# Altium schematic sheet LPCB225 - OVERVIEW.SchDoc
size A3; Address1: Factory 10; Address2: 9-13 Dingley Avenue, Dandeong, VICTORIA 3175, AUSTRALIA; DocumentNumber: 1; Revision: 1; SheetNumber: 1; SheetTotal: 6; Lockie__PCB_SUB_ASSEMBLY: Overview; Lockie__PCB_ASSEMBLY: Module; Lockie__LDL: LPCB225; Lockie__PCB_DESCRIPTION: BMS Module
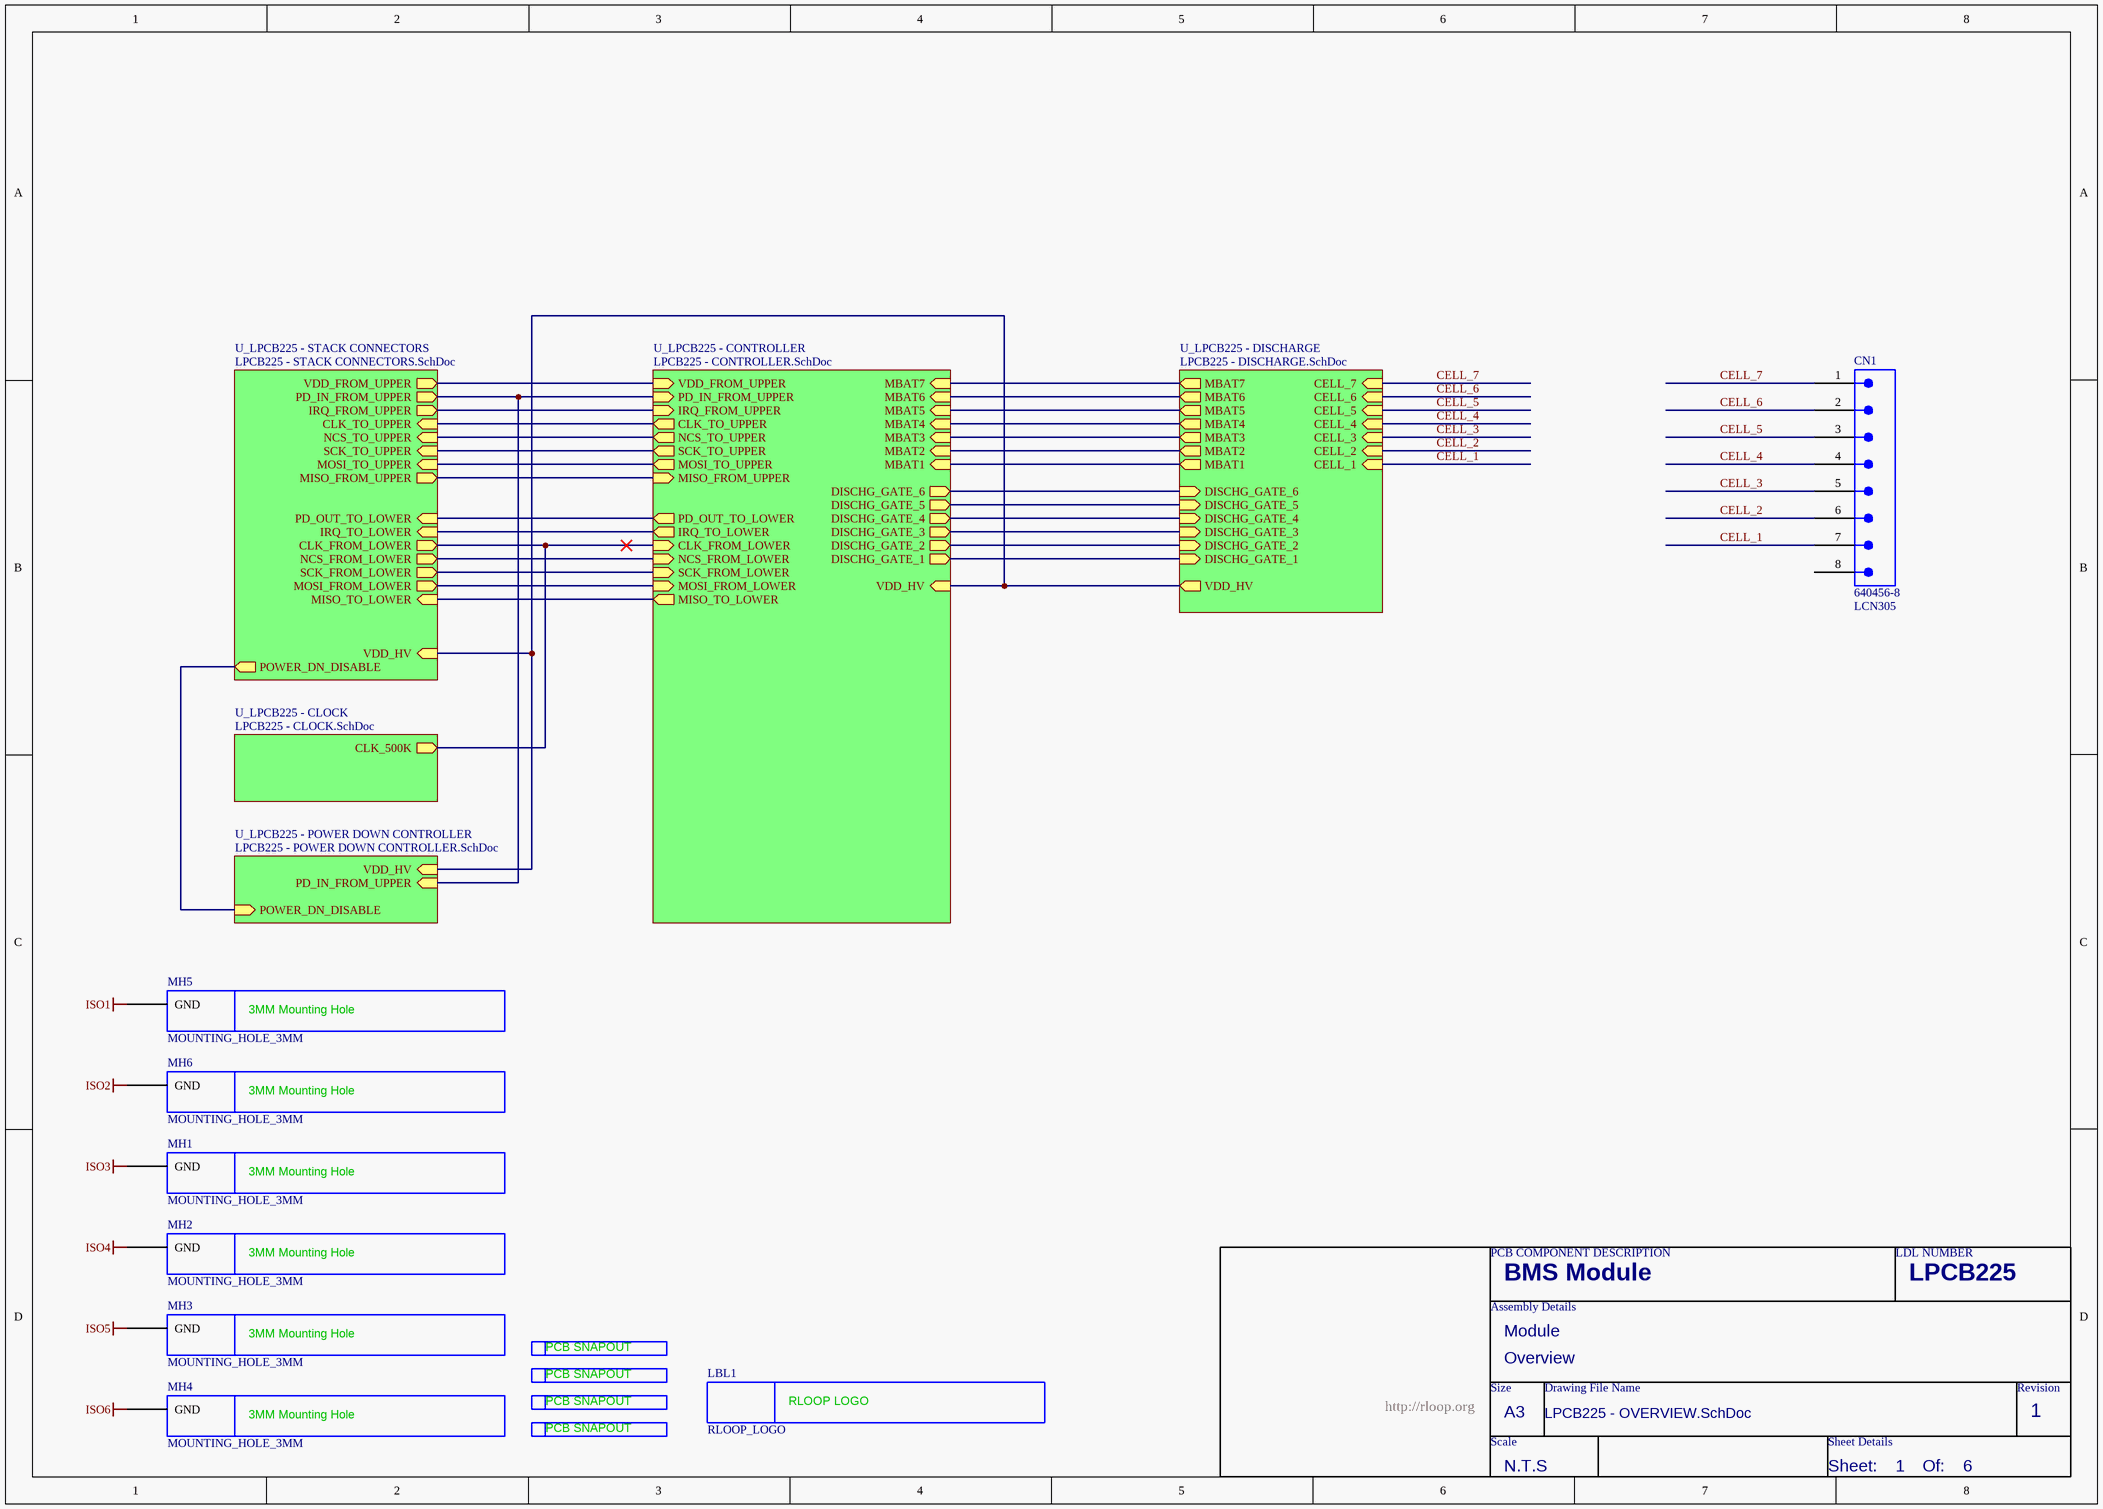
[diagram p0: LPCB225 - OVERVIEW.SchDoc]

## Parts
CN1  640456-8  LDL_NUMBER: LCN305  [640456-8]
LBL1  RLOOP_LOGO  [RLOOP_LOGO]  (no BOM)
MH1  MOUNTING_HOLE_3MM  [MOUNTING_HOLE_3MM]  (no BOM)
MH2  MOUNTING_HOLE_3MM  [MOUNTING_HOLE_3MM]  (no BOM)
MH3  MOUNTING_HOLE_3MM  [MOUNTING_HOLE_3MM]  (no BOM)
MH4  MOUNTING_HOLE_3MM  [MOUNTING_HOLE_3MM]  (no BOM)
MH5  MOUNTING_HOLE_3MM  [MOUNTING_HOLE_3MM]  (no BOM)
MH6  MOUNTING_HOLE_3MM  [MOUNTING_HOLE_3MM]  (no BOM)
SN1  PCB_SNAPOUT  [SNAPOUT_NEW]  (value not drawn)  (no BOM)
SN2  PCB_SNAPOUT  [SNAPOUT_NEW]  (value not drawn)  (no BOM)
SN3  PCB_SNAPOUT  [SNAPOUT_NEW]  (value not drawn)  (no BOM)
SN4  PCB_SNAPOUT  [SNAPOUT_NEW]  (value not drawn)  (no BOM)

## Sub-sheets
U_LPCB225 - CLOCK = LPCB225 - CLOCK.SchDoc: CLK_500K (out)
U_LPCB225 - CONTROLLER = LPCB225 - CONTROLLER.SchDoc: PD_IN_FROM_UPPER (in), PD_OUT_TO_LOWER (out), IRQ_FROM_UPPER (in), CLK_TO_UPPER (out), NCS_TO_UPPER (out), SCK_TO_UPPER (out), MOSI_TO_UPPER (out), MISO_FROM_UPPER (in), IRQ_TO_LOWER (out), CLK_FROM_LOWER (in), NCS_FROM_LOWER (in), SCK_FROM_LOWER (in), MOSI_FROM_LOWER (in), MISO_TO_LOWER (out), VDD_FROM_UPPER (in), VDD_HV (in), MBAT7 (in), MBAT1 (in), MBAT2 (in), MBAT3 (in), MBAT4 (in), MBAT5 (in), MBAT6 (in), DISCHG_GATE_1 (out), DISCHG_GATE_2 (out), DISCHG_GATE_3 (out), DISCHG_GATE_4 (out), DISCHG_GATE_5 (out), DISCHG_GATE_6 (out)
U_LPCB225 - DISCHARGE = LPCB225 - DISCHARGE.SchDoc: CELL_7 (in), MBAT7 (out), DISCHG_GATE_6 (in), MBAT6 (out), DISCHG_GATE_5 (in), CELL_6 (in), MBAT5 (out), DISCHG_GATE_4 (in), CELL_5 (in), MBAT4 (out), DISCHG_GATE_3 (in), CELL_4 (in), MBAT3 (out), DISCHG_GATE_2 (in), CELL_3 (in), MBAT2 (out), DISCHG_GATE_1 (in), CELL_2 (in), CELL_1 (in), MBAT1 (out), VDD_HV (out)
U_LPCB225 - POWER DOWN CONTROLLER = LPCB225 - POWER DOWN CONTROLLER.SchDoc: PD_IN_FROM_UPPER (in), VDD_HV (in), POWER_DN_DISABLE (in)
U_LPCB225 - STACK CONNECTORS = LPCB225 - STACK CONNECTORS.SchDoc: PD_IN_FROM_UPPER (out), IRQ_FROM_UPPER (out), CLK_TO_UPPER (in), NCS_TO_UPPER (in), SCK_TO_UPPER (in), MOSI_TO_UPPER (in), MISO_FROM_UPPER (out), VDD_FROM_UPPER (out), PD_OUT_TO_LOWER (in), IRQ_TO_LOWER (in), CLK_FROM_LOWER (out), NCS_FROM_LOWER (out), SCK_FROM_LOWER (out), MOSI_FROM_LOWER (out), MISO_TO_LOWER (in), VDD_HV (in), POWER_DN_DISABLE (out)

## Nets
ISO1: MH5.MOUNT(GND)
ISO2: MH6.MOUNT(GND)
ISO3: MH1.MOUNT(GND)
ISO4: MH2.MOUNT(GND)
ISO5: MH3.MOUNT(GND)
ISO6: MH4.MOUNT(GND)
CELL_1: CN1.7 ; sheet U_LPCB225 - DISCHARGE/CELL_1
CELL_2: CN1.6 ; sheet U_LPCB225 - DISCHARGE/CELL_2
CELL_3: CN1.5 ; sheet U_LPCB225 - DISCHARGE/CELL_3
CELL_4: CN1.4 ; sheet U_LPCB225 - DISCHARGE/CELL_4
CELL_5: CN1.3 ; sheet U_LPCB225 - DISCHARGE/CELL_5
CELL_6: CN1.2 ; sheet U_LPCB225 - DISCHARGE/CELL_6
CELL_7: CN1.1 ; sheet U_LPCB225 - DISCHARGE/CELL_7
(unnamed): sheet U_LPCB225 - CONTROLLER/PD_IN_FROM_UPPER, sheet U_LPCB225 - STACK CONNECTORS/PD_IN_FROM_UPPER, sheet U_LPCB225 - POWER DOWN CONTROLLER/PD_IN_FROM_UPPER
(unnamed): sheet U_LPCB225 - CONTROLLER/PD_OUT_TO_LOWER, sheet U_LPCB225 - STACK CONNECTORS/PD_OUT_TO_LOWER
(unnamed): sheet U_LPCB225 - CONTROLLER/IRQ_FROM_UPPER, sheet U_LPCB225 - STACK CONNECTORS/IRQ_FROM_UPPER
(unnamed): sheet U_LPCB225 - CONTROLLER/CLK_TO_UPPER, sheet U_LPCB225 - STACK CONNECTORS/CLK_TO_UPPER
(unnamed): sheet U_LPCB225 - CONTROLLER/NCS_TO_UPPER, sheet U_LPCB225 - STACK CONNECTORS/NCS_TO_UPPER
(unnamed): sheet U_LPCB225 - CONTROLLER/SCK_TO_UPPER, sheet U_LPCB225 - STACK CONNECTORS/SCK_TO_UPPER
(unnamed): sheet U_LPCB225 - CONTROLLER/MOSI_TO_UPPER, sheet U_LPCB225 - STACK CONNECTORS/MOSI_TO_UPPER
(unnamed): sheet U_LPCB225 - CONTROLLER/MISO_FROM_UPPER, sheet U_LPCB225 - STACK CONNECTORS/MISO_FROM_UPPER
(unnamed): sheet U_LPCB225 - CONTROLLER/IRQ_TO_LOWER, sheet U_LPCB225 - STACK CONNECTORS/IRQ_TO_LOWER
(unnamed): sheet U_LPCB225 - CONTROLLER/CLK_FROM_LOWER, sheet U_LPCB225 - STACK CONNECTORS/CLK_FROM_LOWER, sheet U_LPCB225 - CLOCK/CLK_500K
(unnamed): sheet U_LPCB225 - CONTROLLER/NCS_FROM_LOWER, sheet U_LPCB225 - STACK CONNECTORS/NCS_FROM_LOWER
(unnamed): sheet U_LPCB225 - CONTROLLER/SCK_FROM_LOWER, sheet U_LPCB225 - STACK CONNECTORS/SCK_FROM_LOWER
(unnamed): sheet U_LPCB225 - CONTROLLER/MOSI_FROM_LOWER, sheet U_LPCB225 - STACK CONNECTORS/MOSI_FROM_LOWER
(unnamed): sheet U_LPCB225 - CONTROLLER/MISO_TO_LOWER, sheet U_LPCB225 - STACK CONNECTORS/MISO_TO_LOWER
(unnamed): sheet U_LPCB225 - CONTROLLER/VDD_FROM_UPPER, sheet U_LPCB225 - STACK CONNECTORS/VDD_FROM_UPPER
(unnamed): sheet U_LPCB225 - CONTROLLER/VDD_HV, sheet U_LPCB225 - DISCHARGE/VDD_HV, sheet U_LPCB225 - STACK CONNECTORS/VDD_HV, sheet U_LPCB225 - POWER DOWN CONTROLLER/VDD_HV
(unnamed): sheet U_LPCB225 - CONTROLLER/MBAT7, sheet U_LPCB225 - DISCHARGE/MBAT7
(unnamed): sheet U_LPCB225 - CONTROLLER/MBAT1, sheet U_LPCB225 - DISCHARGE/MBAT1
(unnamed): sheet U_LPCB225 - CONTROLLER/MBAT2, sheet U_LPCB225 - DISCHARGE/MBAT2
(unnamed): sheet U_LPCB225 - CONTROLLER/MBAT3, sheet U_LPCB225 - DISCHARGE/MBAT3
(unnamed): sheet U_LPCB225 - CONTROLLER/MBAT4, sheet U_LPCB225 - DISCHARGE/MBAT4
(unnamed): sheet U_LPCB225 - CONTROLLER/MBAT5, sheet U_LPCB225 - DISCHARGE/MBAT5
(unnamed): sheet U_LPCB225 - CONTROLLER/MBAT6, sheet U_LPCB225 - DISCHARGE/MBAT6
(unnamed): sheet U_LPCB225 - CONTROLLER/DISCHG_GATE_1, sheet U_LPCB225 - DISCHARGE/DISCHG_GATE_1
(unnamed): sheet U_LPCB225 - CONTROLLER/DISCHG_GATE_2, sheet U_LPCB225 - DISCHARGE/DISCHG_GATE_2
(unnamed): sheet U_LPCB225 - CONTROLLER/DISCHG_GATE_3, sheet U_LPCB225 - DISCHARGE/DISCHG_GATE_3
(unnamed): sheet U_LPCB225 - CONTROLLER/DISCHG_GATE_4, sheet U_LPCB225 - DISCHARGE/DISCHG_GATE_4
(unnamed): sheet U_LPCB225 - CONTROLLER/DISCHG_GATE_5, sheet U_LPCB225 - DISCHARGE/DISCHG_GATE_5
(unnamed): sheet U_LPCB225 - CONTROLLER/DISCHG_GATE_6, sheet U_LPCB225 - DISCHARGE/DISCHG_GATE_6
(unnamed): sheet U_LPCB225 - STACK CONNECTORS/POWER_DN_DISABLE, sheet U_LPCB225 - POWER DOWN CONTROLLER/POWER_DN_DISABLE

Not connected (* = marked no-connect by the designer): CN1 8

## Notes on the sheet
- PCB COMPONENT DESCRIPTION
- LDL NUMBER
- Assembly Details
- Size
- Drawing File Name
- Revision
- http://rloop.org
- Scale
- A3
- Sheet Details
- N.T.S
- Sheet:
- Of:
- (in symbol MOUNTING_HOLE_3MM) 3MM Mounting Hole
- (in symbol PCB_SNAPOUT) PCB SNAPOUT
- (in symbol RLOOP_LOGO) RLOOP LOGO

## Library data of the parts
CN1 = 640456-8: Connector, Male Header, 8 Way; FMEDA__CHANNEL: COM; FMEDA__OPERATING__CURRENT_MAX: 0; FMEDA__OPERATING__TEMP_MAX: 50; FMEDA__OPERATING__TEMP_MIN: -20; FMEDA__OPERATING__TEMP_TYP: 27; FMEDA__OPERATING__VOLTAGE_MAX: 16; FMEDA__OPERATING__VOLTAGE_TYP: 12; FMEDA__FUNCTION_IN_SYSTEM: *; FMEDA__OPERATING__CURRENT_MIN: 0; FMEDA__OPERATING__CURRENT_TYP: 0; FMEDA__OPERATING__VOLTAGE_MIN: 0
LBL1 = RLOOP_LOGO: FMEDA__CHANNEL: DIAG; FMEDA__FUNCTION_IN_SYSTEM: *
MH1-MH6 = MOUNTING_HOLE_3MM: 3MM Mouting Hole; FMEDA__CHANNEL: DIAG; FMEDA__FUNCTION_IN_SYSTEM: *
SN1-SN4 = PCB_SNAPOUT: FMEDA__CHANNEL: DIAG; FMEDA__FUNCTION_IN_SYSTEM: *